# Altium project New_Energizer.PrjPcb
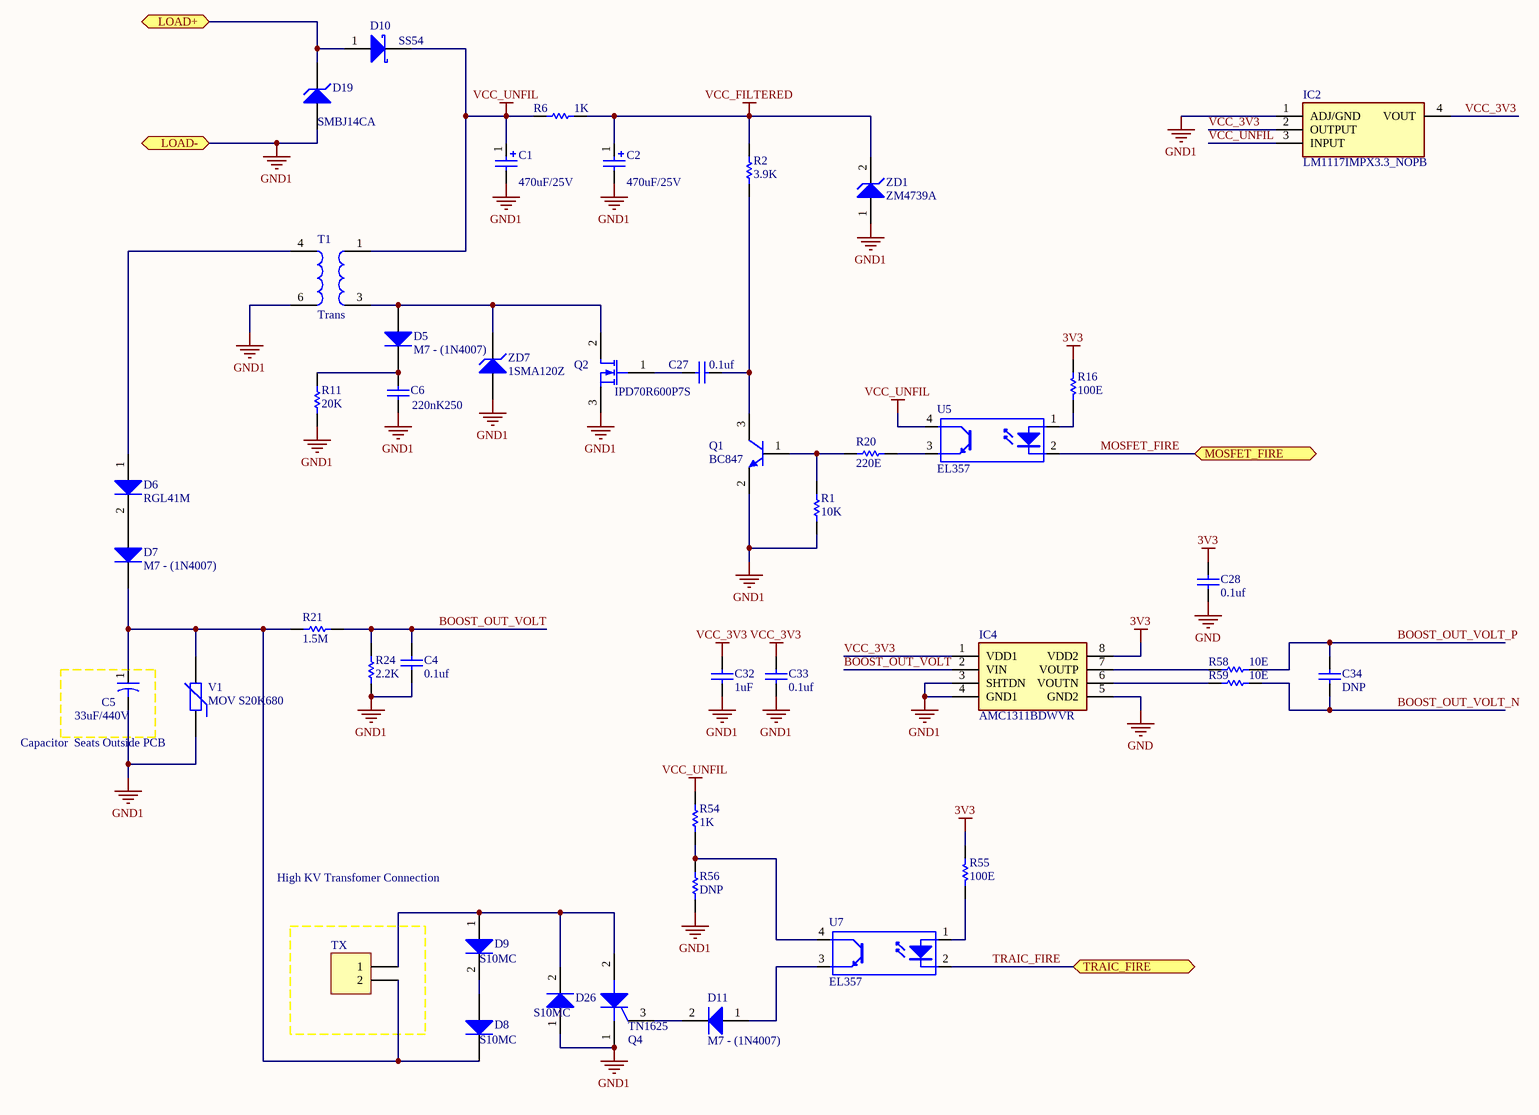
[diagram p0: Voltage_Booster.SchDoc]
5 sheets, 143 parts. Net scope: global (net labels, ports and power ports of the same name join across sheets).
Board file: New_Energizer_SMD.PcbDoc
Sheets:
  Voltage_Booster.SchDoc
  Controller_SolarCharge.SchDoc
  Controller.SchDoc
  Controller_Part.SchDoc
  GSM_Module.SchDoc

## Sheet Voltage_Booster.SchDoc
size 508 x 241 mm

### Parts
C1  value 470uF/25V  [Cap_470uf_10X10.2mm]  (hidden comment: Cap Pol1)
C2  value 470uF/25V  [Cap_470uf_10X10.2mm]  (hidden comment: Cap Pol1)
C4  value 0.1uf  [0805]  (hidden comment: Cap)
C5  value 33uF/440V  [ENERGIZER_CONNECTOR]  (hidden comment: Cap2)
C6  value 220nK250  [RES AXIAL-0.6]  (hidden comment: Cap)
C27  value 0.1uf  [0805]  (hidden comment: Cap)
C28  value 0.1uf  [0805]  (hidden comment: Cap)
C32  value 1uF  [0805]  (hidden comment: Cap)
C33  value 0.1uf  [0805]  (hidden comment: Cap)
C34  value DNP  [0805]  (hidden comment: Cap)
D5  M7 - (1N4007)  [SMA]
D6  RGL41M  [DO-213AB]
D7  M7 - (1N4007)  [SMA]
D8  S10MC  [SMC]
D9  S10MC  [SMC]
D10  SS54  [SMC]
D11  M7 - (1N4007)  [SMA]
D19  SMBJ14CA  [SMA]
D26  S10MC  [SMC]
IC2  LM1117IMPX3.3_NOPB  [SOT230P700X180-4N]
IC4  AMC1311BDWVR  [SOIC127P1150X280-8N]
Q1  BC847  [SOT-23]
Q2  IPD70R600P7S  [TO252 (DPAK)]
Q4  TN1625  [D2PAK]
R1  value 10K  [1206]  (hidden comment: Res1)
R2  value 3.9K  [1206]  (hidden comment: Res1)
R6  value 1K  [2512]  (hidden comment: Res1)
R11  value 20K  [1206]  (hidden comment: Res1)
R16  value 100E  [0805]  (hidden comment: Res1)
R20  value 220E  [1206]  (hidden comment: Res1)
R21  value 1.5M  [1206]  (hidden comment: Res1)
R24  value 2.2K  [1206]  (hidden comment: Res1)
R54  value 1K  [1206]  (hidden comment: Res1)
R55  value 100E  [0805]  (hidden comment: Res1)
R56  value DNP  [1206]  (hidden comment: Res1)
R58  value 10E  [0805]  (hidden comment: Res1)
R59  value 10E  [0805]  (hidden comment: Res1)
T1  Trans  [TRANSFORMER_ENERGIZER]
TX  High KV Transfomer Connection  [ENERGIZER_CONNECTOR]
U5  EL357  [SOP4]
U7  EL357  [SOP4]
V1  MOV S20K680  [3225k471]
ZD1  ZM4739A  [SMA]
ZD7  1SMA120Z  [SMA]

### Ports
LOAD+, LOAD-, MOSFET_FIRE, TRAIC_FIRE

### Nets
3V3: C28.2 IC4.8(VDD2) R16.2 R55.2
GND: C28.1 IC4.5(GND2)  [project net BATT-]
GND1: C1.2 C2.2 C4.1 C5.2 C6.1 C32.1 C33.1 D19.1(A) D26.1(A) IC2.1(ADJ/GND) IC4.3(SHTDN) IC4.4(GND1) Q1.2(E) Q2.3(S) Q4.1(K) R1.2 R11.1 R24.2 R56.1 T1.6 V1.1 ZD1.1(A) ZD7.1(A) ; port LOAD-  [project net LOAD-]
VCC_3V3: C32.2 C33.2 IC2.2(OUTPUT) IC2.4(VOUT) IC4.1(VDD1)
VCC_FILTERED: C2.1 R2.2 R6.2 ZD1.2(K)
VCC_UNFIL: C1.1 D10.2 IC2.3(INPUT) R6.1 R54.2 T1.1 U5.4(C)
BOOST_OUT_VOLT: C4.2 IC4.2(VIN) R21.2 R24.1
BOOST_OUT_VOLT_N: C34.1 R59.2
BOOST_OUT_VOLT_P: C34.2 R58.2
LOAD+: D10.1(A) D19.2(K) ; port LOAD+
MOSFET_FIRE: U5.2(K) ; port MOSFET_FIRE
TRAIC_FIRE: U7.2(K) ; port TRAIC_FIRE
NetC5_1: C5.1 D7.2(K) D8.2(K) R21.1 TX.2 V1.2
NetC6_2: C6.2 D5.2(K) R11.2
NetC27_1: C27.1 Q1.3(C) R2.1
NetC27_2: C27.2 Q2.1(G)
NetD5_1: D5.1(A) Q2.2(D) T1.3 ZD7.2(K)
NetD6_1: D6.1(A) T1.4
NetD6_2: D6.2(K) D7.1(A)
NetD8_1: D8.1(A) D9.2(K)
NetD9_1: D9.1(A) D26.2(K) Q4.2(A) TX.1
NetD11_1: D11.1(A) U7.3(E)
NetD11_2: D11.2(K) Q4.3(G)
NetIC4_6: IC4.6(VOUTN) R59.1
NetIC4_7: IC4.7(VOUTP) R58.1
NetQ1_1: Q1.1(B) R1.1 R20.1
NetR16_1: R16.1 U5.1(A)
NetR20_2: R20.2 U5.3(E)
NetR54_1: R54.1 R56.2 U7.4(C)
NetR55_1: R55.1 U7.1(A)

### Notes on the sheet
- Capacitor  Seats Outside PCB

### Library data of the parts
C1 C2 = Cap Pol1: Polarized Capacitor (Radial); Published: 8-Jun-2000; LatestRevisionDate: 17-Jul-2002; LatestRevisionNote: Re-released for DXP Platform.; PackageReference: RB7.6-15; Publisher: Altium Limited; PackageDescription: Polarized Capacitor (Radial); 2 Leads
C4 C6 C27 C28 C32-C34 = Cap: Capacitor; Published: 8-Jun-2000; LatestRevisionDate: 17-Jul-2002; LatestRevisionNote: Re-released for DXP Platform.; PackageReference: RAD-0.3; Publisher: Altium Limited; PackageDescription: Radial Cap, Thru-Hole; 2 Leads; 0.3 in Pin Spacing
C5 = Cap2: Capacitor; Published: 23-Sep-2002; PackageReference: CAPR5-4X5; Publisher: Altium Limited; PackageDescription: Capacitor; 2 Leads
D5-D7 = Diode 1N5408: 3 Amp Medium Power Silicon Rectifier Diode; Published: 8-Jun-2000; LatestRevisionDate: 17-Jul-2002; LatestRevisionNote: Re-released for DXP Platform.; DatasheetVersion: Aug-1984; PackageReference: DO-201AD; Publisher: Altium Limited; PackageDescription: Diode, Axial; Body 9.5 x 5.3 mm (LxDia. max), Lead Dia. 1.32 mm (max); ComponentLink1Description: Manufacturer Link; ComponentLink1URL: http://www.irf.com/
D8 D9 = Diode: Default Diode; Published: 8-Jun-2000; LatestRevisionDate: 17-Jul-2002; LatestRevisionNote: Re-released for DXP Platform.; PackageVersion: Sep-1996; PackageReference: SMC; Publisher: Altium Limited; PackageDescription: DO-214-AB/SMC; 2 C-Bend Leads; Body 7.9 x 5.9 mm, inc. leads (LxW); Code_JEDEC: DO-214-AB
D10 = Diode BAT17: Silicon RF Schottky Diode for Mixer Applications in the VHF/UHF Range; Note: Pin 2 is not connected and not drawn.; Published: 21-Mar-2003; LatestRevisionDate: 29-May-2009; LatestRevisionNote: IPC-7351 Footprint Added.; DatasheetVersion: Oct-1999; PackageVersion: Sep-2001; PackageReference: SOT-23; Publisher: Altium Limited; PackageDescription: 3-Pin SOT-23 Package 0.95 mm Pitch, 2.5 mm Lead Span; ComponentLink1Description: Manufacturer Link; ComponentLink1URL: http://www.infineon.com/; ComponentLink2Description: Datasheet; ComponentLink2URL: http://www.infineon.com/upload/Document/cmc_upload/documents/009/363/bat17series.pdf
D11 = Diode 1N4007: 1 Amp General Purpose Rectifier; Published: 8-Jun-2000; LatestRevisionDate: 17-Jul-2002; LatestRevisionNote: Re-released for DXP Platform.; DatasheetVersion: 1998; PackageVersion: Aug-1999; PackageReference: DO-41; Publisher: Altium Limited; PackageDescription: Diode, Axial; Body 5.2 x 2.7 mm (LxDia. max), Lead Dia. 0.86 mm (max); Code_JEDEC: DO-204-AL; ComponentLink1Description: Manufacturer Link; ComponentLink1URL: http://www.fairchildsemi.com/; ComponentLink2Description: Datasheet; ComponentLink2URL: http://www.fairchildsemi.com/ds/1N%2F1N4001.pdf
D19 ZD7 = D Zener: Zener Diode; Published: 8-Jun-2000; LatestRevisionDate: 17-Jul-2002; LatestRevisionNote: Re-released for DXP Platform.; PackageReference: DIODE-0.7; Publisher: Altium Limited; PackageDescription: Diode, Thru-Hole; 2 Leads; 0.7 in Pin Spacing
D26 = Diode 1N4007: Diode P600M; Published: 8-Jun-2000; LatestRevisionDate: 17-Jul-2002; LatestRevisionNote: Re-released for DXP Platform.; DatasheetVersion: 1998; PackageVersion: Aug-1999; PackageReference: DO-41; Publisher: Altium Limited; PackageDescription: Diode, Axial; Body 5.2 x 2.7 mm (LxDia. max), Lead Dia. 0.86 mm (max); Code_JEDEC: DO-204-AL; ComponentLink1Description: Manufacturer Link; ComponentLink1URL: http://www.fairchildsemi.com/; ComponentLink2Description: Datasheet; ComponentLink2URL: http://www.fairchildsemi.com/ds/1N%2F1N4001.pdf
IC2 = LM1117IMPX3.3_NOPB: Integrated Circuit; Manufacturer_Name: Texas Instruments; Manufacturer_Part_Number: LM1117IMPX3.3/NOPB; Datasheet Link: http://www.ti.com/lit/ds/symlink/lm1117.pdf; Height: 1.8mm
IC4 = AMC1311BDWVR: Integrated Circuit; Manufacturer_Name: Texas Instruments; Datasheet Link: http://www.ti.com/lit/gpn/amc1311; Height: 2.8mm; Manufacturer_Part_Number: AMC1311BDWVR; Mouser Part Number: 595-AMC1311BDWVR; Mouser Price/Stock: https://www.mouser.co.uk/ProductDetail/Texas-Instruments/AMC1311BDWVR/?qs=W0yvOO0ixfFQekR98E4CkQ%3D%3D; Arrow Part Number: AMC1311BDWVR; Arrow Price/Stock: https://www.arrow.com/en/products/amc1311bdwvr/texas-instruments
Q1 = 2N3904: NPN General Purpose Amplifier; Published: 8-Jun-2000; LatestRevisionDate: 15-Jan-2003; LatestRevisionNote: PCB Footprint 'BCY-W3/D4.7' replaced; DatasheetVersion: 1997; PackageVersion: Sep-1998; PackageReference: TO-92A; Publisher: Altium Limited; PackageDescription: TO, Flat Index; 3 In-Line, Axial Leads; Body Dia. 4.5mm; Leads 0.51 x 0.48 mm (max); ComponentLink1Description: Manufacturer Link; ComponentLink1URL: http://www.fairchildsemi.com/; ComponentLink2Description: Datasheet; ComponentLink2URL: http://www.fairchildsemi.com/ds/2N%2F2N3904.pdf
Q2 = MOSFET-N: N-Channel MOSFET; Published: 8-Jun-2000; LatestRevisionDate: 17-Jul-2002; LatestRevisionNote: Re-released for DXP Platform.; PackageVersion: 1995/1996; PackageReference: E3; Publisher: Altium Limited; PackageDescription: TO, Flat Index; 3 In-Line, Axial Leads; Body Dia. 4.6mm; Lead Dia. 0.5 mm (max)
Q4 = SCR: Silicon Controlled Rectifier; Published: 8-Jun-2000; LatestRevisionDate: 17-Jul-2002; LatestRevisionNote: Re-released for DXP Platform.; PackageReference: TO-220-AB; Publisher: Altium Limited; Code_JEDEC: TO-220-AB
R1 R2 R6 R11 R16 R20 R21 R24 R54-R56 R58 R59 = Res1: Resistor; Published: 8-Jun-2000; LatestRevisionDate: 17-Jul-2002; LatestRevisionNote: Re-released for DXP Platform.; PackageReference: AXIAL-0.3; Publisher: Altium Limited; PackageDescription: Axial Device, Thru-Hole; 2 Leads; 0.3 in Pin Spacing
T1 = Trans: Transformer For Voltage Booster; Published: 24-Mar-1999; LatestRevisionDate: 08-Jul-2005; LatestRevisionNote: Mech Layer 1 removed.; PackageReference: TRANS; Publisher: Altium Limited; PackageDescription: Transformer; 4 Leads
TX = Header 2: Header, 2-Pin; LatestRevisionDate: 17-Jul-2002; LatestRevisionNote: Re-released for DXP Platform.; Publisher: Altium Limited
U5 U7 = Optoisolator1: 4-Pin Phototransistor Optocoupler; Published: 24-Mar-1999; LatestRevisionDate: 04-Mar-2005; LatestRevisionNote: Sch pins 3 & 4 Swapped.; DatasheetVersion: Nov-2003; PackageReference: DIP-4; Publisher: Altium Limited
V1 = Res Varistor: Varistor (Voltage-Sensitive Resistor); Published: 24-Mar-1999; LatestRevisionDate: 29-May-2009; LatestRevisionNote: IPC-7351 Footprint Added.; PackageVersion: Mar-2003; PackageReference: 6-0805; Publisher: Altium Limited; PackageDescription: Chip Resistor 0805 Case Size; Code_IPC: RESC2012
ZD1 = D Zener: Zener Diode; Value: 9.8V; Published: 8-Jun-2000; LatestRevisionDate: 17-Jul-2002; LatestRevisionNote: Re-released for DXP Platform.; PackageReference: DIODE-0.7; Publisher: Altium Limited; PackageDescription: Diode, Thru-Hole; 2 Leads; 0.7 in Pin Spacing

## Sheet Controller_SolarCharge.SchDoc
size B
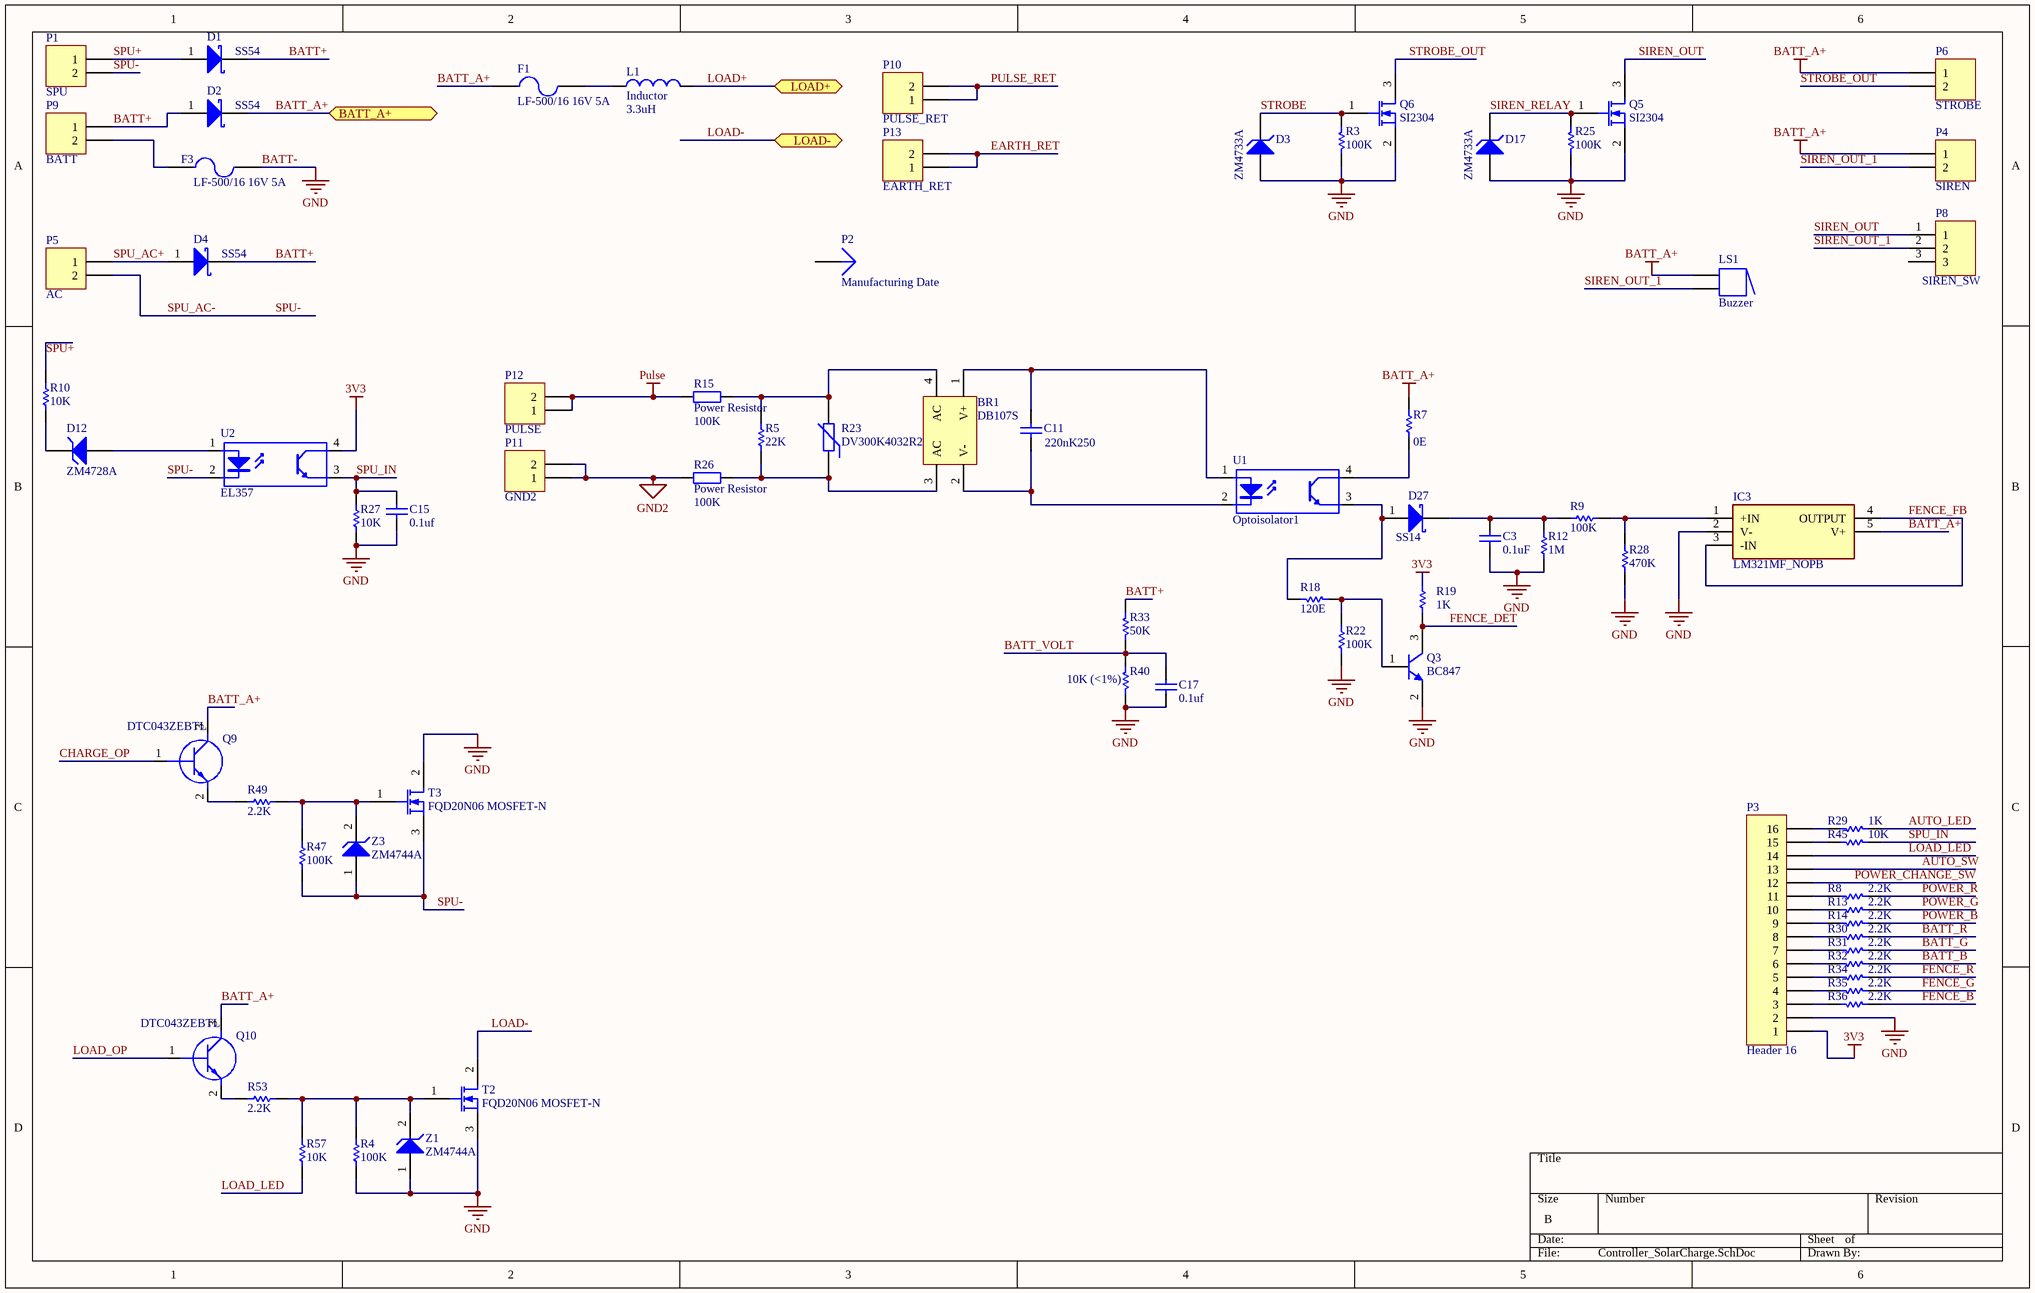
[diagram p1: Controller_SolarCharge.SchDoc]

### Parts
BR1  DB107S  [DB-S_Bridge Rectifier]
C3  value 0.1uF  [0805]  (hidden comment: Cap)
C11  value 220nK250  [RES AXIAL-0.6]  (hidden comment: Cap)
C15  value 0.1uf  [0805]  (hidden comment: Cap)
C17  value 0.1uf  [0805]  (hidden comment: Cap)
D1  SS54  [SMC]
D2  SS54  [SMC]
D3  ZM4733A  [SMA]
D4  SS54  [SMC]
D12  ZM4728A  [SMA]
D17  ZM4733A  [SMA]
D27  SS14  [SMA]
F1  LF-500/16 16V 5A  [LF500-16]
F3  LF-500/16 16V 5A  [LF500-16]
IC3  LM321MF_NOPB  [SOT95P280X145-5N]
L1  Inductor  value 3.3uH  [Inductor_SMD_3.3uh]
LS1  Buzzer  [BUZZER]
P1  SPU  [SCREW_TERMINAL 2PIN 5.08MM]
P2  Manufacturing Date  [MFT_DATE]
P3  Header 16  [FPC_CON_16PIN]
P4  SIREN  [SCREW_TERMINAL 2PIN 5.08MM]
P5  AC  [SCREW_TERMINAL 2PIN 5.08MM]
P6  STROBE  [SCREW_TERMINAL 2PIN 5.08MM]
P8  SIREN_SW  [SWITCH_SLIDE]
P9  BATT  [SCREW_TERMINAL 2PIN 5.08MM]
P10  PULSE_RET  [SCREW_TERMINAL ENERGIZER]
P11  GND2  [SCREW_TERMINAL ENERGIZER]
P12  PULSE  [SCREW_TERMINAL ENERGIZER]
P13  EARTH_RET  [SCREW_TERMINAL ENERGIZER]
Q3  BC847  [SOT-23]
Q5  SI2304  [SOT-23]
Q6  SI2304  [SOT-23]
Q9  DTC043ZEBTL  [SOTFL50P160X85-3N]
Q10  DTC043ZEBTL  [SOTFL50P160X85-3N]
R3  value 100K  [0805]  (hidden comment: Res1)
R4  value 100K  [0805]  (hidden comment: Res1)
R5  value 22K  [POWER_RES 5W_35mm]  (hidden comment: Res1)
R7  value 0E  [0805]  (hidden comment: Res1)
R8  value 2.2K  [0805]  (hidden comment: Res1)
R9  value 100K  [0805]  (hidden comment: Res1)
R10  value 10K  [0805]  (hidden comment: Res1)
R12  value 1M  [0805]  (hidden comment: Res1)
R13  value 2.2K  [0805]  (hidden comment: Res1)
R14  value 2.2K  [0805]  (hidden comment: Res1)
R15  Power Resistor  value 100K  [POWER_RES 5W_35mm]
R18  value 120E  [0805]  (hidden comment: Res1)
R19  value 1K  [0805]  (hidden comment: Res1)
R22  value 100K  [0805]  (hidden comment: Res1)
R23  DV300K4032R2  [3225k471]
R25  value 100K  [0805]  (hidden comment: Res1)
R26  Power Resistor  value 100K  [POWER_RES 5W_35mm]
R27  value 10K  [0805]  (hidden comment: Res1)
R28  value 470K  [0805]  (hidden comment: Res1)
R29  value 1K  [0805]  (hidden comment: Res1)
R30  value 2.2K  [0805]  (hidden comment: Res1)
R31  value 2.2K  [0805]  (hidden comment: Res1)
R32  value 2.2K  [0805]  (hidden comment: Res1)
R33  value 50K  [0805]  (hidden comment: Res1)
R34  value 2.2K  [0805]  (hidden comment: Res1)
R35  value 2.2K  [0805]  (hidden comment: Res1)
R36  value 2.2K  [0805]  (hidden comment: Res1)
R40  value 10K (<1%)  [0805]  (hidden comment: Res1)
R45  value 10K  [0805]  (hidden comment: Res1)
R47  value 100K  [0805]  (hidden comment: Res1)
R49  value 2.2K  [0805]  (hidden comment: Res1)
R53  value 2.2K  [0805]  (hidden comment: Res1)
R57  value 10K  [0805]  (hidden comment: Res1)
T2  FQD20N06 MOSFET-N  [TO252 (DPAK)]
T3  FQD20N06 MOSFET-N  [TO252 (DPAK)]
U1  Optoisolator1  [IR ISOLATED]
U2  EL357  [SOP4]
Z1  ZM4744A  [SMA]
Z3  ZM4744A  [SMA]

### Ports
BATT_A+, LOAD+, LOAD-

### Nets
3V3: P3.1 R19.2 U2.4(C)
BATT-: C3.2 C15.1 C17.2 D3.1(A) D17.1(A) F3.2 IC3.2(V-) P3.2 Q3.2(E) Q5.2(S) Q6.2(S) R3.1 R4.1 R12.1 R22.1 R25.1 R27.1 R28.1 R40.1 T2.3(S) T3.2(D) Z1.1(A)  [also labelled GND]
BATT_A+: D2.2 F1.1 IC3.5(V+) LS1.1 P4.1 P6.1 Q9.3(C) Q10.3(C) R7.2 ; port BATT_A+
GND2: P11.1 P11.2 R26.1
LOAD-: T2.2(D) ; port LOAD-
Pulse: P12.1 P12.2 R15.1
AUTO_LED: R29.1
AUTO_SW: P3.13
BATT+: D1.2 D2.1(A) D4.2 P9.1 R33.2
BATT_B: R32.1
BATT_G: R31.1
BATT_R: R30.1
BATT_VOLT: C17.1 R33.1 R40.2
CHARGE_OP: Q9.1(B)
EARTH_RET: P13.1 P13.2
FENCE_B: R36.1
FENCE_DET: Q3.3(C) R19.1
FENCE_FB: IC3.3(-IN) IC3.4(OUTPUT)
FENCE_G: R35.1
FENCE_R: R34.1
LOAD+: L1.2 ; port LOAD+
LOAD_LED: P3.14 R57.1
LOAD_OP: Q10.1(B)
POWER_B: R14.1
POWER_CHANGE_SW: P3.12
POWER_G: R13.1
POWER_R: R8.1
PULSE_RET: P10.1 P10.2
SIREN_OUT: P8.1 Q5.3(D)
SIREN_OUT_1: LS1.2 P4.2 P8.2
SIREN_RELAY: D17.2(K) Q5.1(G) R25.2
SPU+: D1.1(A) P1.1 R10.2
SPU-: P1.2 P5.2 R47.1 T3.3(S) U2.2(K) Z3.1(A)  [also labelled SPU_AC-]
SPU_AC+: D4.1(A) P5.1
SPU_IN: C15.2 R27.2 R45.1 U2.3(E)
STROBE: D3.2(K) Q6.1(G) R3.2
STROBE_OUT: P6.2 Q6.3(D)
NetBR1_1: BR1.1(V+) C11.2 U1.1(A)
NetBR1_2: BR1.2(V-) C11.1 U1.2(K)
NetBR1_3: BR1.3(AC) R5.2 R23.1 R26.2
NetBR1_4: BR1.4(AC) R5.1 R15.2 R23.2
NetC3_1: C3.1 D27.2 R9.2 R12.2
NetD12_1: D12.1(A) U2.1(A)
NetD12_2: D12.2(K) R10.1
NetD27_1: D27.1(A) R18.2 U1.3(E)
NetF1_2: F1.2 L1.1
NetF3_1: F3.1 P9.2
NetIC3_1: IC3.1(+IN) R9.1 R28.2
NetP3_3: P3.3 R36.2
NetP3_4: P3.4 R35.2
NetP3_5: P3.5 R34.2
NetP3_6: P3.6 R32.2
NetP3_7: P3.7 R31.2
NetP3_8: P3.8 R30.2
NetP3_9: P3.9 R14.2
NetP3_10: P3.10 R13.2
NetP3_11: P3.11 R8.2
NetP3_15: P3.15 R45.2
NetP3_16: P3.16 R29.2
NetQ3_1: Q3.1(B) R18.1 R22.2
NetQ9_2: Q9.2(E) R49.2
NetQ10_2: Q10.2(E) R53.2
NetR4_2: R4.2 R53.1 R57.2 T2.1(G) Z1.2(K)
NetR7_1: R7.1 U1.4(C)
NetR47_2: R47.2 R49.1 T3.1(G) Z3.2(K)

Not connected (* = marked no-connect by the designer): P2 1; P8 3

### Library data of the parts
BR1 = Bridge2: Diode Bridge; Published: 24-Mar-1999; LatestRevisionDate: 17-Jul-2002; LatestRevisionNote: Re-released for DXP Platform.; PackageReference: D-46_6A; Publisher: Altium Limited; PackageDescription: Bridge Rectifier; 4 Terminals; Body 16.8 x 16.8 mm (typ); Pitch 10.67 mm
C3 C11 C15 C17 = Cap: Capacitor; Published: 8-Jun-2000; LatestRevisionDate: 17-Jul-2002; LatestRevisionNote: Re-released for DXP Platform.; PackageReference: RAD-0.3; Publisher: Altium Limited; PackageDescription: Radial Cap, Thru-Hole; 2 Leads; 0.3 in Pin Spacing
D1 D2 D4 D27 = Diode BAT17: as D10 on sheet Voltage_Booster; Published: 21-Mar-2003; LatestRevisionDate: 29-May-2009; LatestRevisionNote: IPC-7351 Footprint Added.; DatasheetVersion: Oct-1999; PackageVersion: Sep-2001; PackageReference: SOT-23; Publisher: Altium Limited; PackageDescription: 3-Pin SOT-23 Package 0.95 mm Pitch, 2.5 mm Lead Span; ComponentLink1Description: Manufacturer Link; ComponentLink1URL: http://www.infineon.com/; ComponentLink2Description: Datasheet; ComponentLink2URL: http://www.infineon.com/upload/Document/cmc_upload/documents/009/363/bat17series.pdf
D3 D17 = D Zener: TVS Diode; Published: 8-Jun-2000; LatestRevisionDate: 17-Jul-2002; LatestRevisionNote: Re-released for DXP Platform.; PackageReference: DIODE-0.7; Publisher: Altium Limited; PackageDescription: Diode, Thru-Hole; 2 Leads; 0.7 in Pin Spacing
D12 Z1 Z3 = D Zener: Zener Diode; Published: 8-Jun-2000; LatestRevisionDate: 17-Jul-2002; LatestRevisionNote: Re-released for DXP Platform.; PackageReference: DIODE-0.7; Publisher: Altium Limited; PackageDescription: Diode, Thru-Hole; 2 Leads; 0.7 in Pin Spacing
F1 F3 = Fuse 2: Fuse; Published: 8-Jun-2000; LatestRevisionDate: 17-Jul-2002; LatestRevisionNote: Re-released for DXP Platform.; PackageReference: PIN-W2/E2.8; Publisher: Altium Limited; PackageDescription: Thru-Hole; 2 Leads
IC3 = LM321MF_NOPB: Integrated Circuit; Manufacturer_Name: Texas Instruments; Manufacturer_Part_Number: LM321MF/NOPB; Datasheet Link: https://datasheet.datasheetarchive.com/originals/distributors/Datasheets-SFU2/DSASFU100036193.pdf; Height: 1.45mm; Mouser Part Number: 926-LM321MF/NOPB; Mouser Price/Stock: https://www.mouser.co.uk/ProductDetail/Texas-Instruments/LM321MF-NOPB?qs=X1J7HmVL2ZEjaSKPrGsivQ%3D%3D; Arrow Part Number: LM321MF/NOPB; Arrow Price/Stock: https://www.arrow.com/en/products/lm321mfnopb/texas-instruments?region=nac
L1 = Inductor: Code_IEC: 1005; Published: 8-Jun-2000; LatestRevisionDate: 29-May-2009; LatestRevisionNote: IPC-7351 Footprint Added.; PackageReference: 0402-A; Publisher: Altium Limited; PackageDescription: Chip Inductor; Code_JEITA: 0402
LS1 = Buzzer: Magnetic Transducer Buzzer; Published: 24-Mar-1999; LatestRevisionDate: 17-Dec-2003; LatestRevisionNote: Schematic revised, PCB Footprint replaced.; DatasheetVersion: 17-Dec-2003; PackageReference: ABSM-1574; Publisher: Altium Limited; PackageDescription: Magnetic Transducer Buzzer; ComponentLink1Description: Manufacturer Link; ComponentLink1URL: http://www.megastar.com/linecard/buzzmode/index.php
P1 P4-P6 P9 = Header 2: SCREW_TERMINAL 2PIN 5.08MM; LatestRevisionDate: 17-Jul-2002; LatestRevisionNote: Re-released for DXP Platform.; Publisher: Altium Limited
P2 = Plug: LatestRevisionDate: 17-Jul-2002; LatestRevisionNote: Re-released for DXP Platform.; Publisher: Altium Limited
P3 = Header 16: Header, 16-Pin; LatestRevisionDate: 17-Jul-2002; LatestRevisionNote: Re-released for DXP Platform.; Publisher: Altium Limited
P8 = Header 3: Header, 3-Pin; LatestRevisionDate: 17-Jul-2002; LatestRevisionNote: Re-released for DXP Platform.; Publisher: Altium Limited
P10 P12 = Header 2: SCREW_TERMINAL 2PIN 9.25MM; LatestRevisionDate: 17-Jul-2002; LatestRevisionNote: Re-released for DXP Platform.; Publisher: Altium Limited
P11 P13 = Header 2: Header, 2-Pin; LatestRevisionDate: 17-Jul-2002; LatestRevisionNote: Re-released for DXP Platform.; Publisher: Altium Limited
Q3 = 2N3904: NPN General Purpose Amplifier; Published: 8-Jun-2000; LatestRevisionDate: 15-Jan-2003; LatestRevisionNote: PCB Footprint 'BCY-W3/D4.7' replaced; DatasheetVersion: 1997; PackageVersion: Sep-1998; PackageReference: TO-92A; Publisher: Altium Limited; PackageDescription: TO, Flat Index; 3 In-Line, Axial Leads; Body Dia. 4.5mm; Leads 0.51 x 0.48 mm (max); ComponentLink1Description: Manufacturer Link; ComponentLink1URL: http://www.fairchildsemi.com/; ComponentLink2Description: Datasheet; ComponentLink2URL: http://www.fairchildsemi.com/ds/2N%2F2N3904.pdf
Q5 Q6 = MOSFET-N: SI2304 A4SHB MOSFET-N; Published: 8-Jun-2000; LatestRevisionDate: 17-Jul-2002; LatestRevisionNote: Re-released for DXP Platform.; PackageVersion: 1995/1996; PackageReference: E3; Publisher: Altium Limited; PackageDescription: TO, Flat Index; 3 In-Line, Axial Leads; Body Dia. 4.6mm; Lead Dia. 0.5 mm (max)
Q9 Q10 = DTC043ZEBTL: Transistor BJT NPN; Manufacturer_Name: ROHM Semiconductor; Datasheet Link: http://rohmfs.rohm.com/en/products/databook/datasheet/discrete/transistor/digital/dtc043zmt2l-e.pdf; Height: 0.85mm; Manufacturer_Part_Number: DTC043ZEBTL; Mouser Part Number: 755-DTC043ZEBTL; Mouser Price/Stock: https://www.mouser.co.uk/ProductDetail/ROHM-Semiconductor/DTC043ZEBTL?qs=n7vHx8wJlDGyWrBOh0icRQ%3D%3D
R3-R5 R7-R10 R12-R14 R18 R19 R22 R25 R27-R36 R40 R45 R47 R49 R53 R57 = Res1: Resistor; Published: 8-Jun-2000; LatestRevisionDate: 17-Jul-2002; LatestRevisionNote: Re-released for DXP Platform.; PackageReference: AXIAL-0.3; Publisher: Altium Limited; PackageDescription: Axial Device, Thru-Hole; 2 Leads; 0.3 in Pin Spacing
R15 R26 = Res2: Resistor; Published: 8-Jun-2000; LatestRevisionDate: 17-Jul-2002; LatestRevisionNote: Re-released for DXP Platform.; PackageReference: AXIAL-0.4; Publisher: Altium Limited; PackageDescription: Axial Device, Thru-Hole; 2 Leads; 0.4 in Pin Spacing
R23 = Res Varistor: Varistor (Voltage-Sensitive Resistor); Published: 24-Mar-1999; LatestRevisionDate: 29-May-2009; LatestRevisionNote: IPC-7351 Footprint Added.; PackageVersion: Mar-2003; PackageReference: 6-0805; Publisher: Altium Limited; PackageDescription: Chip Resistor 0805 Case Size; Code_IPC: RESC2012
T2 T3 = MOSFET-N: N-Channel MOSFET; Published: 8-Jun-2000; LatestRevisionDate: 17-Jul-2002; LatestRevisionNote: Re-released for DXP Platform.; PackageVersion: 1995/1996; PackageReference: E3; Publisher: Altium Limited; PackageDescription: TO, Flat Index; 3 In-Line, Axial Leads; Body Dia. 4.6mm; Lead Dia. 0.5 mm (max)
U1 = Optoisolator1: Optocoupler for Return; Published: 24-Mar-1999; LatestRevisionDate: 04-Mar-2005; LatestRevisionNote: Sch pins 3 & 4 Swapped.; DatasheetVersion: Nov-2003; PackageReference: DIP-4; Publisher: Altium Limited
U2 = Optoisolator1: 4-Pin Phototransistor Optocoupler; Published: 24-Mar-1999; LatestRevisionDate: 04-Mar-2005; LatestRevisionNote: Sch pins 3 & 4 Swapped.; DatasheetVersion: Nov-2003; PackageReference: DIP-4; Publisher: Altium Limited

## Sheet Controller.SchDoc
size A4
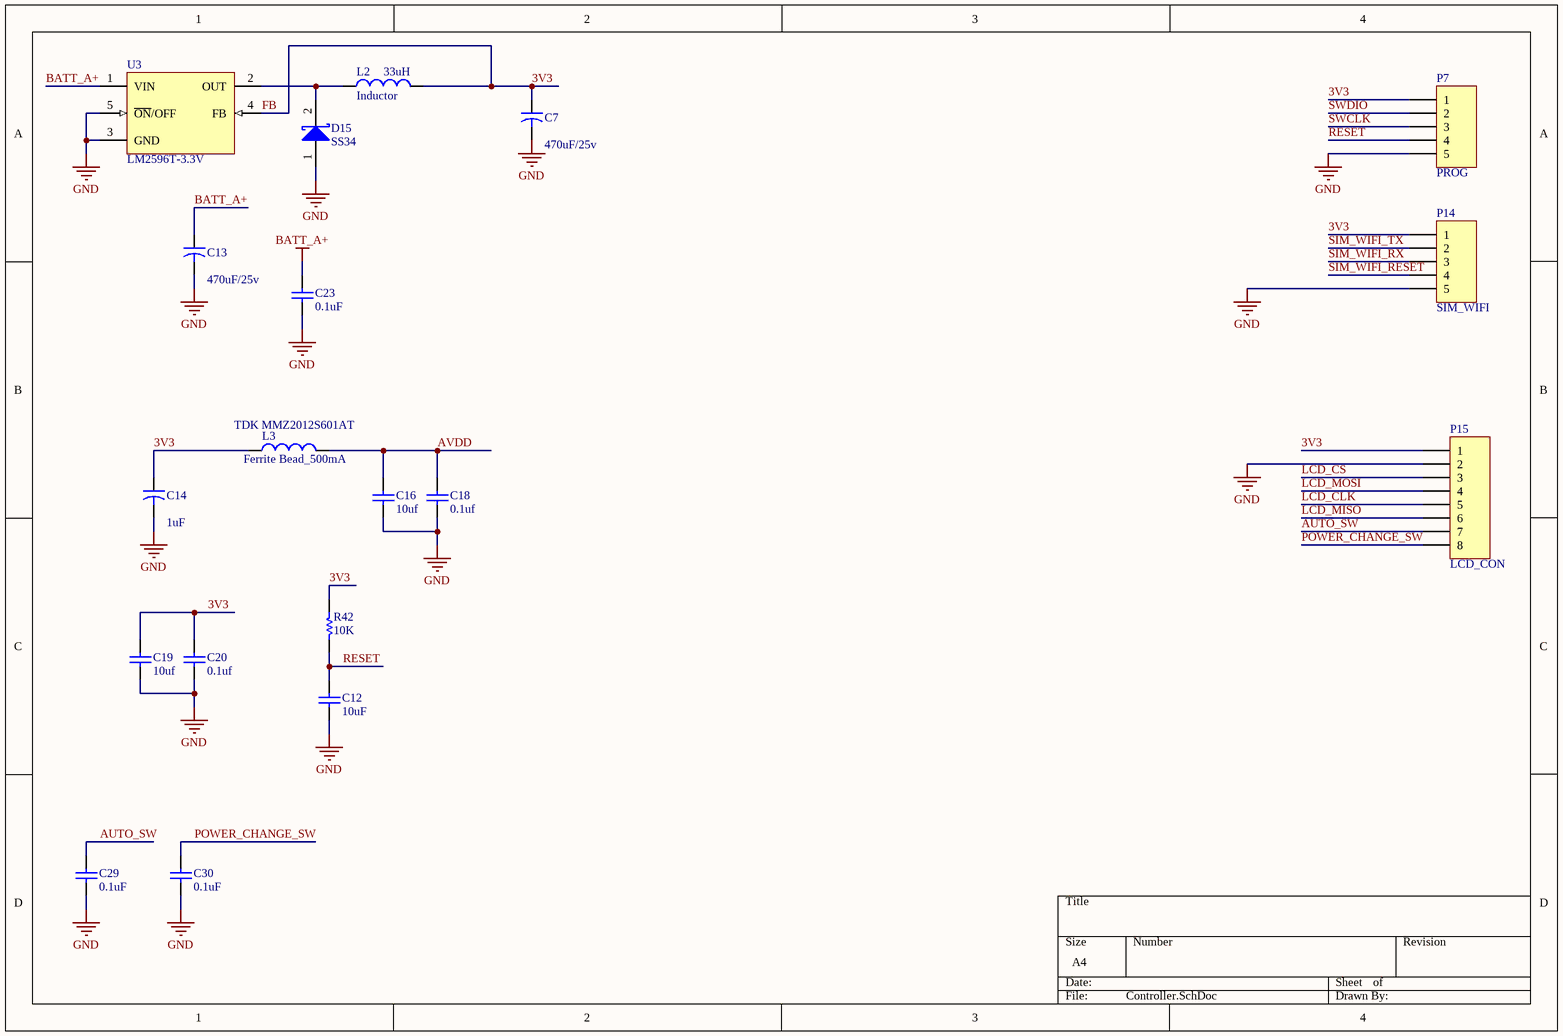
[diagram p2: Controller.SchDoc]

### Parts
C7  value 470uF/25v  [Cap_470uf_10X10.2mm]  (hidden comment: Cap2)
C12  value 10uF  [0805]  (hidden comment: Cap)
C13  value 470uF/25v  [Cap_470uf_10X10.2mm]  (hidden comment: Cap2)
C14  value 1uF  [0805]  (hidden comment: Cap2)
C16  value 10uf  [0805]  (hidden comment: Cap)
C18  value 0.1uf  [0805]  (hidden comment: Cap)
C19  value 10uf  [0805]  (hidden comment: Cap)
C20  value 0.1uf  [0805]  (hidden comment: Cap)
C23  value 0.1uF  [0805]  (hidden comment: Cap)
C29  value 0.1uF  [0805]  (hidden comment: Cap)
C30  value 0.1uF  [0805]  (hidden comment: Cap)
D15  SS34  [SMA]
L2  Inductor  value 33uH  [Inductor_SMD_33uh]
L3  Ferrite Bead_500mA  value TDK MMZ2012S601AT  [0805]
P7  PROG  [HDR1X5]
P14  SIM_WIFI  [HDR1X5]
P15  LCD_CON  [HDR1X8]
R42  value 10K  [0805]  (hidden comment: Res1)
U3  LM2596T-3.3V  [LM2596S50TR]

### Nets
3V3: C7.1 C14.1 C19.2 C20.2 L2.2 L3.1 P7.1 P14.1 P15.1 R42.1 U3.4(FB)  [also labelled FB]
BATT_A+: C13.1 C23.1 U3.1(VIN)
GND: C7.2 C12.1 C13.2 C14.2 C16.1 C18.1 C19.1 C20.1 C23.2 C29.2 C30.2 D15.1(A) P7.5 P14.5 P15.2 U3.3(GND) U3.5(~{ON}/OFF)  [project net BATT-]
AUTO_SW: C29.1 P15.7
AVDD: C16.2 C18.2 L3.2
LCD_CLK: P15.5
LCD_CS: P15.3
LCD_MISO: P15.6
LCD_MOSI: P15.4
POWER_CHANGE_SW: C30.1 P15.8
RESET: C12.2 P7.4 R42.2
SIM_WIFI_RESET: P14.4
SIM_WIFI_RX: P14.3
SIM_WIFI_TX: P14.2
SWCLK: P7.3
SWDIO: P7.2
NetD15_2: D15.2(K) L2.1 U3.2(OUT)

### Library data of the parts
C7 C13 C14 = Cap2: Capacitor; Published: 23-Sep-2002; PackageReference: CAPR5-4X5; Publisher: Altium Limited; PackageDescription: Capacitor; 2 Leads
C12 C16 C18-C20 C23 C29 C30 = Cap: Capacitor; Published: 8-Jun-2000; LatestRevisionDate: 17-Jul-2002; LatestRevisionNote: Re-released for DXP Platform.; PackageReference: RAD-0.3; Publisher: Altium Limited; PackageDescription: Radial Cap, Thru-Hole; 2 Leads; 0.3 in Pin Spacing
D15 = Diode 10TQ035: Schottky Rectifier; Note: Terminal 2 is the TAB and is electrically connected to the cathode; Published: 8-Jun-2000; LatestRevisionDate: 17-Jul-2002; LatestRevisionNote: Re-released for DXP Platform.; DatasheetVersion: PD-2.057B; PackageVersion: Feb-1998; PackageReference: TO-220AC; Publisher: Altium Limited; PackageDescription: TO, Thru-Hole, Vertical, Heatsink Mounted; 3 In-Line Leads (1 Absent); Pitch 2.54 mm; ComponentLink1Description: Manufacturer Link; ComponentLink1URL: http://www.irf.com/; ComponentLink2Description: Datasheet; ComponentLink2URL: http://www.irf.com/product-info/datasheets/data/10tq.pdf
L2 L3 = Inductor: Code_IEC: 1005; Published: 8-Jun-2000; LatestRevisionDate: 29-May-2009; LatestRevisionNote: IPC-7351 Footprint Added.; PackageReference: 0402-A; Publisher: Altium Limited; PackageDescription: Chip Inductor; Code_JEITA: 0402
P7 P14 = Header 5: Header, 5-Pin; LatestRevisionDate: 17-Jul-2002; LatestRevisionNote: Re-released for DXP Platform.; Publisher: Altium Limited
P15 = Header 8: Header, 8-Pin; LatestRevisionDate: 17-Jul-2002; LatestRevisionNote: Re-released for DXP Platform.; Publisher: Altium Limited
R42 = Res1: Resistor; Published: 8-Jun-2000; LatestRevisionDate: 17-Jul-2002; LatestRevisionNote: Re-released for DXP Platform.; PackageReference: AXIAL-0.3; Publisher: Altium Limited; PackageDescription: Axial Device, Thru-Hole; 2 Leads; 0.3 in Pin Spacing
U3 = LM2596T-ADJ: Manufacturer: National Semiconductor; PackageTopMarking: NSUZXYTTE#*LM2596T*-ADJ P+; PowerWise: N; High-Reliability: Y; DatasheetVersion: May-2002; PackageVersion: revA, Oct-1989; PackageReference: T05D; PackageDescription: TO-220, Molded, Stagger Bend, 5 Lead; PartNumber: LM2596T-3.3; RoHS: N; PinCount: 5; ComponentLink1URL: http://www.national.com/; ComponentLink2Description: LM2596 Datasheet; ComponentLink3URL: http://www.national.com/pf/LM/LM2596.html; ComponentLink4Description: T05D Package Page; ComponentLink4URL: http://www.national.com/packaging/folders/t05d.html

## Sheet Controller_Part.SchDoc
size A3
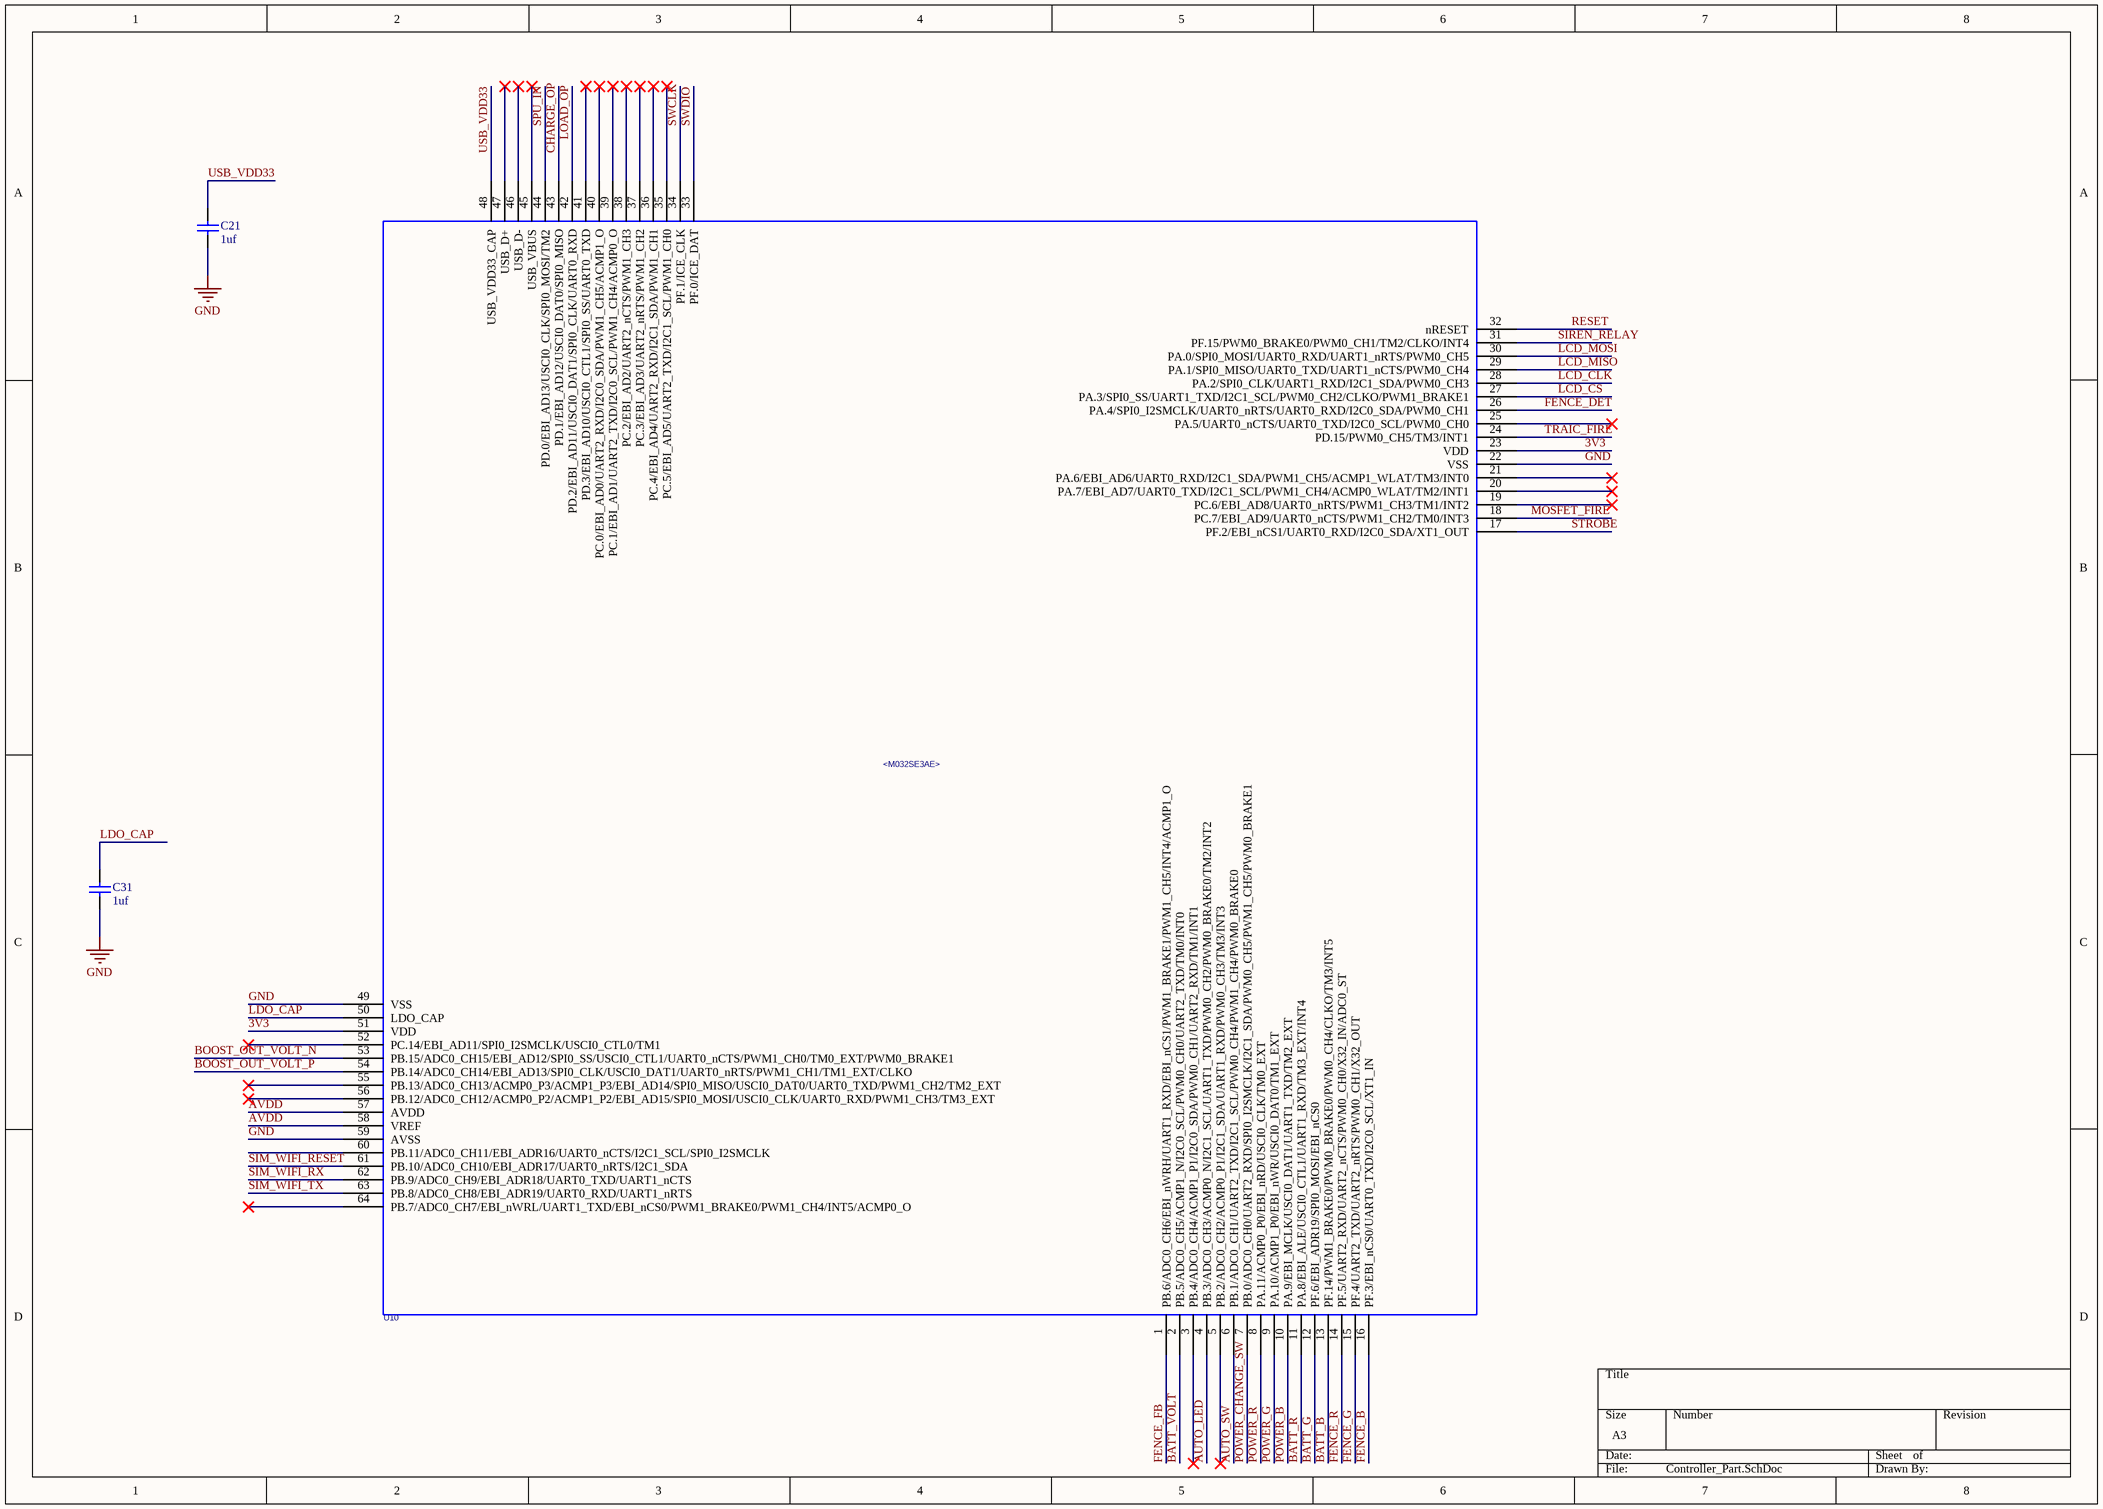
[diagram p3: Controller_Part.SchDoc]

### Parts
C21  value 1uf  [0805]  (hidden comment: Cap)
C31  value 1uf  [0805]  (hidden comment: Cap)
U10  M031SE3AE: <M032SE3AE>  [LQFP-64]  (hidden comment: M031SE3AE)

### Nets
3V3: U10.23(VDD) U10.51(VDD)
GND: C21.1 C31.1 U10.22(VSS) U10.49(VSS) U10.59(AVSS)  [project net BATT-]
AUTO_LED: U10.4(PB.3/ADC0_CH3/ACMP0_N/I2C1_SCL/UART1_TXD/PWM0_CH2/PWM0_BRAKE0/TM2/INT2)
AUTO_SW: U10.6(PB.1/ADC0_CH1/UART2_TXD/I2C1_SCL/PWM0_CH4/PWM1_CH4/PWM0_BRAKE0)
AVDD: U10.57(AVDD) U10.58(VREF)
BATT_B: U10.13(PF.14/PWM1_BRAKE0/PWM0_BRAKE0/PWM0_CH4/CLKO/TM3/INT5)
BATT_G: U10.12(PF.6/EBI_ADR19/SPI0_MOSI/EBI_nCS0)
BATT_R: U10.11(PA.8/EBI_ALE/USCI0_CTL1/UART1_RXD/TM3_EXT/INT4)
BATT_VOLT: U10.2(PB.5/ADC0_CH5/ACMP1_N/I2C0_SCL/PWM0_CH0/UART2_TXD/TM0/INT0)
BOOST_OUT_VOLT_N: U10.53(PB.15/ADC0_CH15/EBI_AD12/SPI0_SS/USCI0_CTL1/UART0_nCTS/PWM1_CH0/TM0_EXT/PWM0_BRAKE1)
BOOST_OUT_VOLT_P: U10.54(PB.14/ADC0_CH14/EBI_AD13/SPI0_CLK/USCI0_DAT1/UART0_nRTS/PWM1_CH1/TM1_EXT/CLKO)
CHARGE_OP: U10.43(PD.1/EBI_AD12/USCI0_DAT0/SPI0_MISO)
FENCE_B: U10.16(PF.3/EBI_nCS0/UART0_TXD/I2C0_SCL/XT1_IN)
FENCE_DET: U10.26(PA.4/SPI0_I2SMCLK/UART0_nRTS/UART0_RXD/I2C0_SDA/PWM0_CH1)
FENCE_FB: U10.1(PB.6/ADC0_CH6/EBI_nWRH/UART1_RXD/EBI_nCS1/PWM1_BRAKE1/PWM1_CH5/INT4/ACMP1_O)
FENCE_G: U10.15(PF.4/UART2_TXD/UART2_nRTS/PWM0_CH1/X32_OUT)
FENCE_R: U10.14(PF.5/UART2_RXD/UART2_nCTS/PWM0_CH0/X32_IN/ADC0_ST)
LCD_CLK: U10.28(PA.2/SPI0_CLK/UART1_RXD/I2C1_SDA/PWM0_CH3)
LCD_CS: U10.27(PA.3/SPI0_SS/UART1_TXD/I2C1_SCL/PWM0_CH2/CLKO/PWM1_BRAKE1)
LCD_MISO: U10.29(PA.1/SPI0_MISO/UART0_TXD/UART1_nCTS/PWM0_CH4)
LCD_MOSI: U10.30(PA.0/SPI0_MOSI/UART0_RXD/UART1_nRTS/PWM0_CH5)
LDO_CAP: C31.2 U10.50(LDO_CAP)
LOAD_OP: U10.42(PD.2/EBI_AD11/USCI0_DAT1/SPI0_CLK/UART0_RXD)
MOSFET_FIRE: U10.18(PC.7/EBI_AD9/UART0_nCTS/PWM1_CH2/TM0/INT3)
POWER_B: U10.10(PA.9/EBI_MCLK/USCI0_DAT1/UART1_TXD/TM2_EXT)
POWER_CHANGE_SW: U10.7(PB.0/ADC0_CH0/UART2_RXD/SPI0_I2SMCLK/I2C1_SDA/PWM0_CH5/PWM1_CH5/PWM0_BRAKE1)
POWER_G: U10.9(PA.10/ACMP1_P0/EBI_nWR/USCI0_DAT0/TM1_EXT)
POWER_R: U10.8(PA.11/ACMP0_P0/EBI_nRD/USCI0_CLK/TM0_EXT)
RESET: U10.32(nRESET)
SIM_WIFI_RESET: U10.61(PB.10/ADC0_CH10/EBI_ADR17/UART0_nRTS/I2C1_SDA)
SIM_WIFI_RX: U10.62(PB.9/ADC0_CH9/EBI_ADR18/UART0_TXD/UART1_nCTS)
SIM_WIFI_TX: U10.63(PB.8/ADC0_CH8/EBI_ADR19/UART0_RXD/UART1_nRTS)
SIREN_RELAY: U10.31(PF.15/PWM0_BRAKE0/PWM0_CH1/TM2/CLKO/INT4)
SPU_IN: U10.44(PD.0/EBI_AD13/USCI0_CLK/SPI0_MOSI/TM2)
STROBE: U10.17(PF.2/EBI_nCS1/UART0_RXD/I2C0_SDA/XT1_OUT)
SWCLK: U10.34(PF.1/ICE_CLK)
SWDIO: U10.33(PF.0/ICE_DAT)
TRAIC_FIRE: U10.24(PD.15/PWM0_CH5/TM3/INT1)
USB_VDD33: C21.2 U10.48(USB_VDD33_CAP)

Not connected (* = marked no-connect by the designer): U10 3(PB.4/ADC0_CH4/ACMP1_P1/I2C0_SDA/PWM0_CH1/UART2_RXD/TM1/INT1)* 5(PB.2/ADC0_CH2/ACMP0_P1/I2C1_SDA/UART1_RXD/PWM0_CH3/TM3/INT3)* 19(PC.6/EBI_AD8/UART0_nRTS/PWM1_CH3/TM1/INT2)* 20(PA.7/EBI_AD7/UART0_TXD/I2C1_SCL/PWM1_CH4/ACMP0_WLAT/TM2/INT1)* 21(PA.6/EBI_AD6/UART0_RXD/I2C1_SDA/PWM1_CH5/ACMP1_WLAT/TM3/INT0)* 25(PA.5/UART0_nCTS/UART0_TXD/I2C0_SCL/PWM0_CH0)* 35(PC.5/EBI_AD5/UART2_TXD/I2C1_SCL/PWM1_CH0)* 36(PC.4/EBI_AD4/UART2_RXD/I2C1_SDA/PWM1_CH1)* 37(PC.3/EBI_AD3/UART2_nRTS/PWM1_CH2)* 38(PC.2/EBI_AD2/UART2_nCTS/PWM1_CH3)* 39(PC.1/EBI_AD1/UART2_TXD/I2C0_SCL/PWM1_CH4/ACMP0_O)* 40(PC.0/EBI_AD0/UART2_RXD/I2C0_SDA/PWM1_CH5/ACMP1_O)* 41(PD.3/EBI_AD10/USCI0_CTL1/SPI0_SS/UART0_TXD)* 45(USB_VBUS)* 46(USB_D-)* 47(USB_D+)* 52(PC.14/EBI_AD11/SPI0_I2SMCLK/USCI0_CTL0/TM1)* 55(PB.13/ADC0_CH13/ACMP0_P3/ACMP1_P3/EBI_AD14/SPI0_MISO/USCI0_DAT0/UART0_TXD/PWM1_CH2/TM2_EXT)* 56(PB.12/ADC0_CH12/ACMP0_P2/ACMP1_P2/EBI_AD15/SPI0_MOSI/USCI0_CLK/UART0_RXD/PWM1_CH3/TM3_EXT)* 60(PB.11/ADC0_CH11/EBI_ADR16/UART0_nCTS/I2C1_SCL/SPI0_I2SMCLK) 64(PB.7/ADC0_CH7/EBI_nWRL/UART1_TXD/EBI_nCS0/PWM1_BRAKE0/PWM1_CH4/INT5/ACMP0_O)*

### Library data of the parts
C21 C31 = Cap: Capacitor; Published: 8-Jun-2000; LatestRevisionDate: 17-Jul-2002; LatestRevisionNote: Re-released for DXP Platform.; PackageReference: RAD-0.3; Publisher: Altium Limited; PackageDescription: Radial Cap, Thru-Hole; 2 Leads; 0.3 in Pin Spacing
U10 = M031SE3AE: OriginalSymbolOrigin: (0,0)

## Sheet GSM_Module.SchDoc
size A
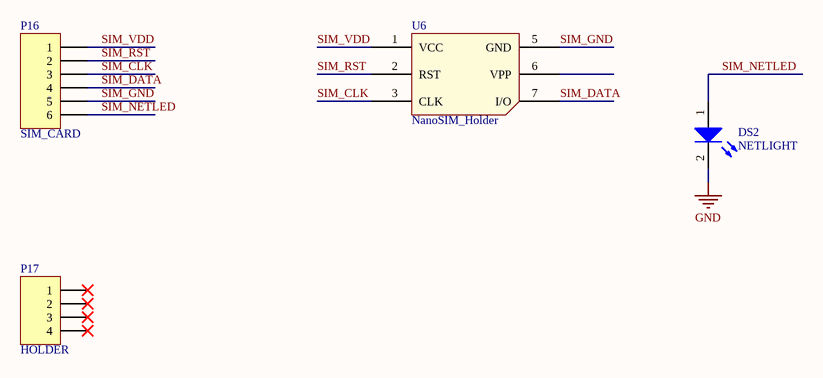
[diagram p4: GSM_Module.SchDoc]

### Parts
DS2  NETLIGHT  [0805_LED]
P16  SIM_CARD  [HDR1X6]
P17  HOLDER  [HDR1X4]
U6  NanoSIM_Holder  [Nano_SIMCard_Holder]

### Nets
GND: DS2.2(K)  [project net BATT-]
SIM_CLK: P16.3 U6.3(CLK)
SIM_DATA: P16.4 U6.7(I/O)
SIM_GND: P16.5 U6.5(GND)
SIM_NETLED: DS2.1(A) P16.6
SIM_RST: P16.2 U6.2(RST)
SIM_VDD: P16.1 U6.1(VCC)

Not connected (* = marked no-connect by the designer): P17 1* 2* 3* 4*; U6 6(VPP)

### Library data of the parts
DS2 = LED0: LED 5mm Diameter; Published: 8-Jun-2000; LatestRevisionDate: 08-Jul-2005; LatestRevisionNote: Mech Layer 1 removed.; PackageReference: LED-0; Publisher: Altium Limited; PackageDescription: LED; 2 Leads
P16 = Header 6: Header, 6-Pin; LatestRevisionDate: 17-Jul-2002; LatestRevisionNote: Re-released for DXP Platform.; Publisher: Altium Limited
P17 = Header 4: Header, 4-Pin; LatestRevisionDate: 17-Jul-2002; LatestRevisionNote: Re-released for DXP Platform.; Publisher: Altium Limited

## Nets that join several sheets
3V3: Voltage_Booster (C28.2 IC4.8 R16.2 R55.2), Controller_SolarCharge (P3.1 R19.2 U2.4), Controller (11 pins), Controller_Part (U10.23 U10.51)
BATT-: Voltage_Booster (C28.1 IC4.5), Controller_SolarCharge (22 pins), Controller (17 pins), Controller_Part (5 pins), GSM_Module (DS2.2)
BATT_A+: Controller_SolarCharge (9 pins), Controller (C13.1 C23.1 U3.1)
LOAD-: Voltage_Booster (23 pins), Controller_SolarCharge (T2.2)
AUTO_LED: Controller_SolarCharge (R29.1), Controller_Part (U10.4)
AUTO_SW: Controller_SolarCharge (P3.13), Controller (C29.1 P15.7), Controller_Part (U10.6)
AVDD: Controller (C16.2 C18.2 L3.2), Controller_Part (U10.57 U10.58)
BATT_B: Controller_SolarCharge (R32.1), Controller_Part (U10.13)
BATT_G: Controller_SolarCharge (R31.1), Controller_Part (U10.12)
BATT_R: Controller_SolarCharge (R30.1), Controller_Part (U10.11)
BATT_VOLT: Controller_SolarCharge (C17.1 R33.1 R40.2), Controller_Part (U10.2)
BOOST_OUT_VOLT_N: Voltage_Booster (C34.1 R59.2), Controller_Part (U10.53)
BOOST_OUT_VOLT_P: Voltage_Booster (C34.2 R58.2), Controller_Part (U10.54)
CHARGE_OP: Controller_SolarCharge (Q9.1), Controller_Part (U10.43)
FENCE_B: Controller_SolarCharge (R36.1), Controller_Part (U10.16)
FENCE_DET: Controller_SolarCharge (Q3.3 R19.1), Controller_Part (U10.26)
FENCE_FB: Controller_SolarCharge (IC3.3 IC3.4), Controller_Part (U10.1)
FENCE_G: Controller_SolarCharge (R35.1), Controller_Part (U10.15)
FENCE_R: Controller_SolarCharge (R34.1), Controller_Part (U10.14)
LCD_CLK: Controller (P15.5), Controller_Part (U10.28)
LCD_CS: Controller (P15.3), Controller_Part (U10.27)
LCD_MISO: Controller (P15.6), Controller_Part (U10.29)
LCD_MOSI: Controller (P15.4), Controller_Part (U10.30)
LOAD+: Voltage_Booster (D10.1 D19.2), Controller_SolarCharge (L1.2)
LOAD_OP: Controller_SolarCharge (Q10.1), Controller_Part (U10.42)
MOSFET_FIRE: Voltage_Booster (U5.2), Controller_Part (U10.18)
POWER_B: Controller_SolarCharge (R14.1), Controller_Part (U10.10)
POWER_CHANGE_SW: Controller_SolarCharge (P3.12), Controller (C30.1 P15.8), Controller_Part (U10.7)
POWER_G: Controller_SolarCharge (R13.1), Controller_Part (U10.9)
POWER_R: Controller_SolarCharge (R8.1), Controller_Part (U10.8)
RESET: Controller (C12.2 P7.4 R42.2), Controller_Part (U10.32)
SIM_WIFI_RESET: Controller (P14.4), Controller_Part (U10.61)
SIM_WIFI_RX: Controller (P14.3), Controller_Part (U10.62)
SIM_WIFI_TX: Controller (P14.2), Controller_Part (U10.63)
SIREN_RELAY: Controller_SolarCharge (D17.2 Q5.1 R25.2), Controller_Part (U10.31)
SPU_IN: Controller_SolarCharge (C15.2 R27.2 R45.1 U2.3), Controller_Part (U10.44)
STROBE: Controller_SolarCharge (D3.2 Q6.1 R3.2), Controller_Part (U10.17)
SWCLK: Controller (P7.3), Controller_Part (U10.34)
SWDIO: Controller (P7.2), Controller_Part (U10.33)
TRAIC_FIRE: Voltage_Booster (U7.2), Controller_Part (U10.24)